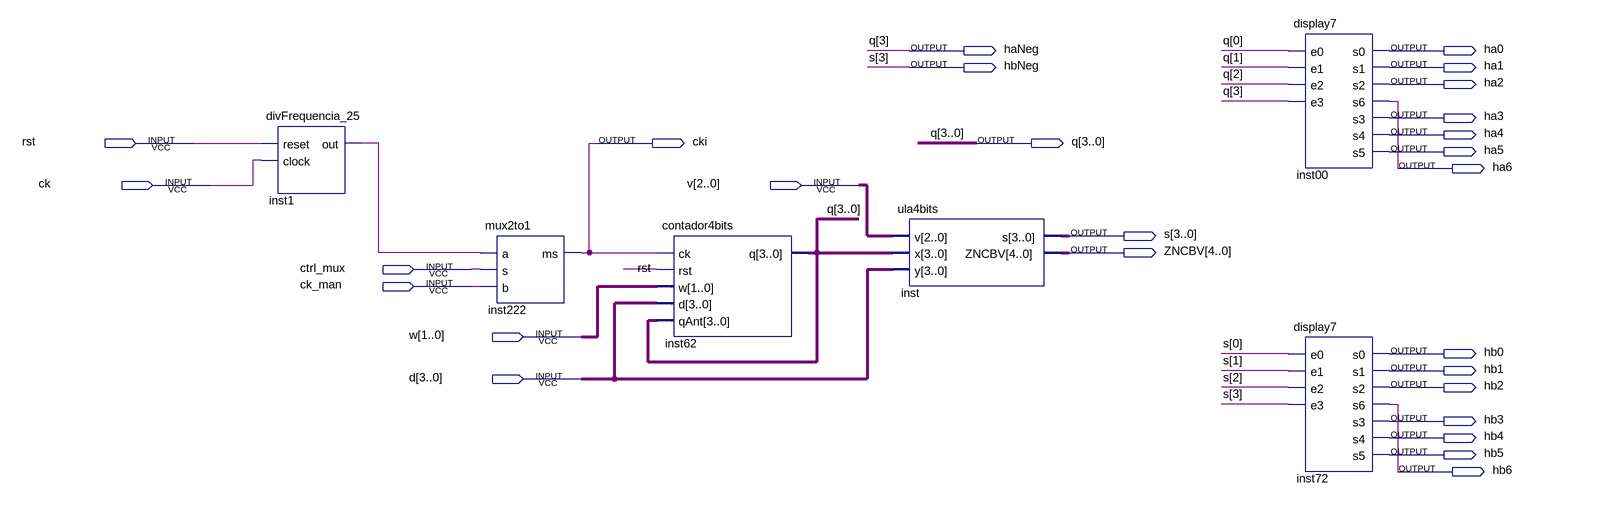
[diagram p0: schematic sheet]
// Quartus schematic trabFinal.bdf as structural Verilog: 6 symbols, 27 pins
module trabFinal (
  input  rst,
  input  ck,
  input  [2:0] v,
  input  ctrl_mux,
  input  ck_man,
  input  [1:0] w,
  input  [3:0] d,
  output haNeg,
  output ha0,
  output hbNeg,
  output ha1,
  output ha2,
  output ha3,
  output ha4,
  output cki,
  output [3:0] q,
  output ha5,
  output ha6,
  output [3:0] s,
  output [4:0] ZNCBV,
  output hb0,
  output hb1,
  output hb2,
  output hb3,
  output hb4,
  output hb5,
  output hb6
);

  wire inst1_out;

  divFrequencia_25 inst1 (.reset(rst), .clock(ck), .out(inst1_out));
  mux2to1 inst222 (.a(inst1_out), .s(ctrl_mux), .b(ck_man), .ms(cki));
  contador4bits inst62 (.ck(cki), .rst(rst), .w(w), .d(d), .qAnt({haNeg, q[2:0]}), .q({haNeg, q[2:0]}));
  ula4bits inst (.v(v), .x({haNeg, q[2:0]}), .y(d), .s({hbNeg, s[2:0]}), .ZNCBV(ZNCBV));
  display7 inst00 (
    .e0(q[0]), .e1(q[1]), .e2(q[2]), .e3(haNeg), .s0(ha0), .s1(ha1), .s2(ha2), .s6(ha6), .s3(ha3), .s4(ha4),
    .s5(ha5));
  display7 inst72 (
    .e0(s[0]), .e1(s[1]), .e2(s[2]), .e3(hbNeg), .s0(hb0), .s1(hb1), .s2(hb2), .s6(hb6), .s3(hb3), .s4(hb4),
    .s5(hb5));

  assign q[3] = haNeg;
  assign s[3] = hbNeg;
endmodule
